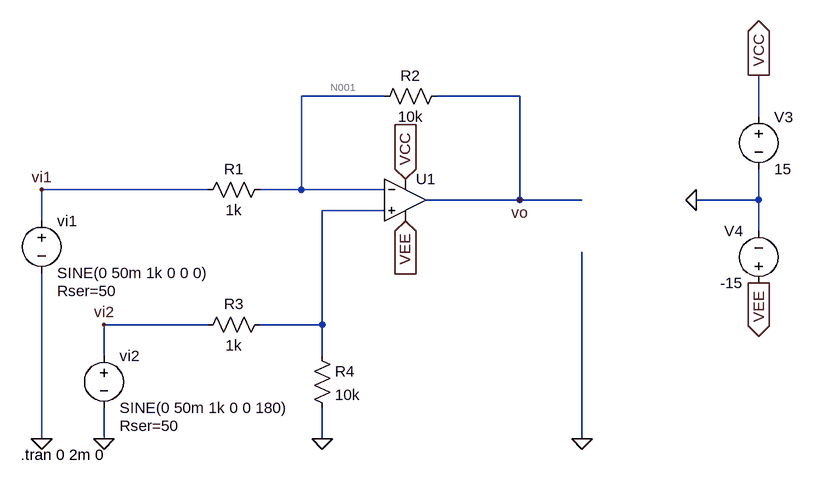
[diagram p0: schematic Lab3p1.asc]
Lab3p1.asc, the LTspice schematic file:
Version 4
SHEET 1 984 856
WIRE 192 -64 64 -64
WIRE 400 -64 272 -64
WIRE 768 -32 768 -96
WIRE -80 80 -336 80
WIRE 64 80 64 -64
WIRE 64 80 0 80
WIRE 192 80 64 80
WIRE 400 96 400 -64
WIRE 400 96 256 96
WIRE 496 96 400 96
WIRE 768 96 768 48
WIRE 768 96 672 96
WIRE 192 112 96 112
WIRE -336 128 -336 80
WIRE 768 144 768 96
WIRE -80 288 -240 288
WIRE 96 288 96 112
WIRE 96 288 0 288
WIRE -240 336 -240 288
WIRE 96 336 96 288
WIRE -336 464 -336 208
WIRE -240 464 -240 416
WIRE 96 464 96 416
WIRE 496 464 496 176
FLAG 224 128 VEE
IOPIN 224 128 In
FLAG 224 64 VCC
IOPIN 224 64 In
FLAG 672 96 0
FLAG 768 -96 VCC
IOPIN 768 -96 Out
FLAG 768 224 VEE
IOPIN 768 224 Out
FLAG 400 96 vo
FLAG 96 464 0
FLAG 496 464 0
FLAG -336 464 0
FLAG -240 464 0
FLAG -336 80 vi1
FLAG -240 288 vi2
SYMBOL OpAmps\\UniversalOpAmp2 224 96 R0
SYMATTR InstName U1
SYMATTR Value2 Avol=200k GBW=1.5Meg Slew=0.5Meg
SYMATTR SpiceLine Ilimit=25m Rail=1 Vos=1m
SYMATTR SpiceLine2 En=0 Enk=0 In=0 Ink=0 Rin=2Meg
SYMBOL voltage 768 -48 R0
SYMATTR InstName V3
SYMATTR Value 15
SYMBOL voltage 768 240 R180
WINDOW 0 24 96 Left 2
WINDOW 3 24 16 Left 2
SYMATTR InstName V4
SYMATTR Value -15
SYMBOL res 16 64 R90
WINDOW 0 0 56 VBottom 2
WINDOW 3 32 56 VTop 2
SYMATTR InstName R1
SYMATTR Value 1k
SYMBOL res 288 -80 R90
WINDOW 0 0 56 VBottom 2
WINDOW 3 32 56 VTop 2
SYMATTR InstName R2
SYMATTR Value 10k
SYMBOL res 16 272 R90
WINDOW 0 0 56 VBottom 2
WINDOW 3 32 56 VTop 2
SYMATTR InstName R3
SYMATTR Value 1k
SYMBOL res 80 320 R0
SYMATTR InstName R4
SYMATTR Value 10k
SYMBOL voltage -336 112 R0
WINDOW 123 0 0 Left 0
WINDOW 39 24 124 Left 2
SYMATTR InstName vi1
SYMATTR Value SINE(0 50m 1k 0 0 0)
SYMATTR SpiceLine Rser=50
SYMBOL voltage -240 320 R0
WINDOW 123 0 0 Left 0
WINDOW 39 24 124 Left 2
SYMATTR InstName vi2
SYMATTR Value SINE(0 50m 1k 0 0 180)
SYMATTR SpiceLine Rser=50
TEXT -368 488 Left 2 !.tran 0 2m 0

The netlist it stands for:
* Lab3p1.asc
XU1 N002 N001 VCC VEE vo level2 Avol=200k GBW=1.5Meg Slew=0.5Meg Ilimit=25m Rail=1 Vos=1m En=0 Enk=0 In=0 Ink=0 Rin=2Meg  ; pins In+ In- V+ V- OUT
V3 VCC 0 15
V4 VEE 0 -15
R1 N001 vi1 1k
R2 vo N001 10k
R3 N002 vi2 1k
R4 N002 0 10k
vi1 vi1 0 SINE(0 50m 1k 0 0 0) Rser=50
vi2 vi2 0 SINE(0 50m 1k 0 0 180) Rser=50
.tran 0 2m 0
.lib UniversalOpAmp2.lib
.backanno
.end

* Results of the author's LTspice run, read from the files saved beside the schematic
* Operating Point, zero values left out:
*   V(vo) = 10.53 mV
*   V(vcc) = 15 V
*   V(vee) = -15 V
*   V(n001) = 999.9 µV
*   V(vi1) = 47.62 µV
*   I(R1) = 952.3 nA
*   I(R2) = 952.8 nA
*   I(V3) = -1.402 mA
*   I(V4) = 1.401 mA
*   I(Vi1) = 952.3 nA
*   Ix(u1:2) = 500 pA
*   Ix(u1:3) = 1.402 mA
*   Ix(u1:4) = -1.401 mA
*   Ix(u1:5) = -952.8 nA
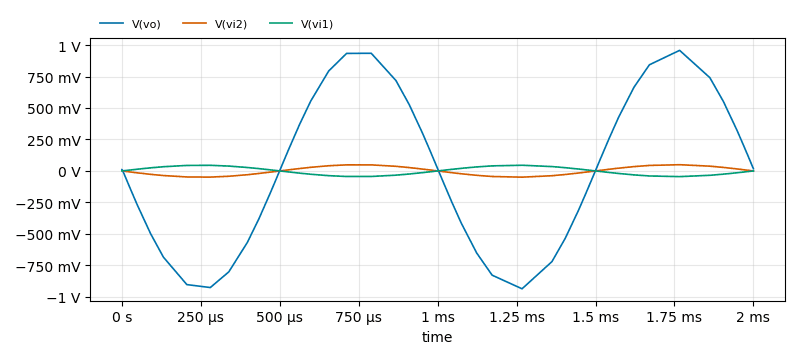
[diagram p1: Transient Analysis of Lab3p1.asc, plotted from the saved traces]
* Transient Analysis, 1 run:
*   V(vo): min -936.2 mV, max 957.8 mV, average 10.3 mV, rms 664.9 mV, last 17.23 mV
*   V(vi2): min -49.45 mV, max 49.48 mV, average -11.69 µV, rms 34.75 mV, last 0 V
*   V(vi1): min -45.14 mV, max 45.21 mV, average 58.27 µV, rms 31.74 mV, last 77.92 µV